# EAGLE schematic UDAWA-SensorWater (EAGLE 9.6.2)
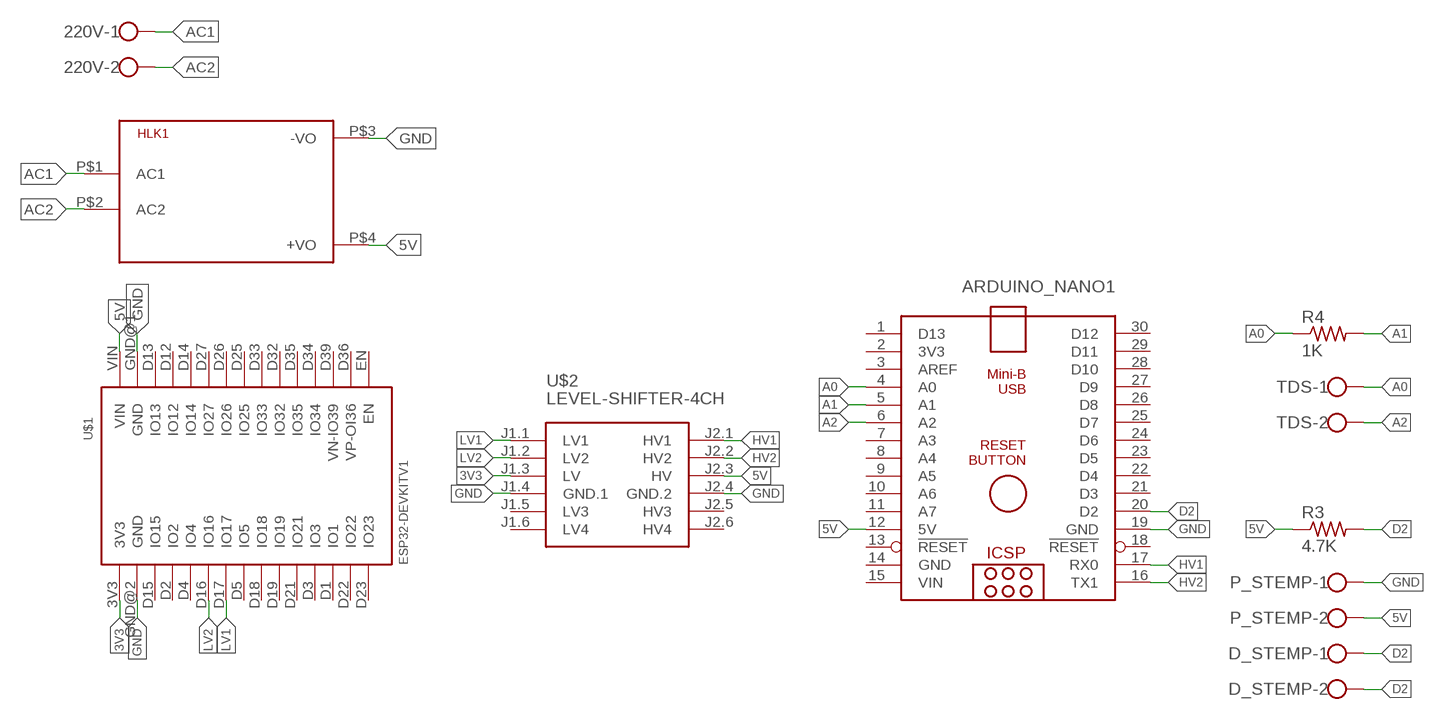
[diagram p0: schematic, sheet 1]

## Parts
220V  W237-102  [W237-102]
ARDUINO_NANO1  ARDUINO_NANO  [ARDUINO_NANO]
D_STEMP  W237-102  [W237-102]
HLK1  HLK-PM013W  [HLK-PM01]
P_STEMP  W237-102  [W237-102]
R3  4.7K  R-US_0204/7  [0204/7]
R4  1K  R-US_0204/7  [0204/7]
TDS  W237-102  [W237-102]
U$1  ESP32DEVKITV1  [ESP32-DEVKITV1]
U$2  LEVEL-SHIFTER-4CH  [LEVEL-SHIFTER-4CH]

## Nets
3V3: U$1.3V3 U$2.J1.3(LV)
5V: ARDUINO_NANO1.12(5V) HLK1.P$4(+VO) P_STEMP.2 R3.1 U$1.VIN U$2.J2.3(HV)
A0: ARDUINO_NANO1.4(A0) R4.1 TDS.1
A1: ARDUINO_NANO1.5(A1) R4.2
A2: ARDUINO_NANO1.6(A2) TDS.2
AC1: 220V.1 HLK1.P$1(AC1)
AC2: 220V.2 HLK1.P$2(AC2)
D2: ARDUINO_NANO1.20(D2) D_STEMP.1 D_STEMP.2 R3.2
GND: ARDUINO_NANO1.19(GND) HLK1.P$3(-VO) P_STEMP.1 U$1.GND@1(GND) U$1.GND@2(GND) U$2.J1.4(GND.1) U$2.J2.4(GND.2)
HV1: ARDUINO_NANO1.17(RX0) U$2.J2.1(HV1)
HV2: ARDUINO_NANO1.16(TX1) U$2.J2.2(HV2)
LV1: U$1.D17(IO17) U$2.J1.1(LV1)
LV2: U$1.D16(IO16) U$2.J1.2(LV2)
Unconnected: ARDUINO_NANO1.1(D13) ARDUINO_NANO1.2(3V3) ARDUINO_NANO1.3(AREF) ARDUINO_NANO1.7(A3) ARDUINO_NANO1.8(A4) ARDUINO_NANO1.9(A5) ARDUINO_NANO1.10(A6) ARDUINO_NANO1.11(A7) ARDUINO_NANO1.13(!RESET) ARDUINO_NANO1.18(!RESET) ARDUINO_NANO1.21(D3) ARDUINO_NANO1.22(D4) ARDUINO_NANO1.23(D5) ARDUINO_NANO1.24(D6) ARDUINO_NANO1.25(D7) ARDUINO_NANO1.26(D8) ARDUINO_NANO1.27(D9) ARDUINO_NANO1.28(D10) ARDUINO_NANO1.29(D11) ARDUINO_NANO1.30(D12) U$1.D1(IO1) U$1.D2(IO2) U$1.D3(IO3) U$1.D4(IO4) U$1.D5(IO5) U$1.D12(IO12) U$1.D13(IO13) U$1.D14(IO14) U$1.D15(IO15) U$1.D18(IO18) U$1.D19(IO19) U$1.D21(IO21) U$1.D22(IO22) U$1.D23(IO23) U$1.D25(IO25) U$1.D26(IO26) U$1.D27(IO27) U$1.D32(IO32) U$1.D33(IO33) U$1.D34(IO34) U$1.D35(IO35) U$1.D36(VP-OI36) U$1.D39(VN-IO39) U$1.EN U$2.J1.5(LV3) U$2.J1.6(LV4) U$2.J2.5(HV3) U$2.J2.6(HV4)

## Power pins joined to a net without a drawn wire
GND: ARDUINO_NANO1.14(GND)
VIN: ARDUINO_NANO1.15(VIN)

## Library data of the parts
220V D_STEMP P_STEMP TDS = con-wago-500:W237-102: WAGO SCREW CLAMP; MPN: 237-102; OC_FARNELL: unknown; OC_NEWARK: 70K9898
ARDUINO_NANO1 = ArduinoNanoV30:ARDUINO_NANO: Arduino Nano V3.0 Overview: The Arduino Nano is a small, complete, and breadboard-friendly board based on the ATmega328 (Arduino Nano 3.x) or ATmega168 (Arduino Nano 2.x). It has more or less the same functionality of the Arduino Duemilanove, but in a different package. It lacks only a DC power jack, and works with a Mini-B USB cable instead of a standard one. The Nano was designed and is being produced by Gravitech. Specifications: Microcontroller Atmel ATmega168 or ATmega328 Operating Voltage (logic level) 5 V Input Voltage (recommended) 7-12 V Input Voltage (limits) 6-20 V Digital I/O Pins 14 (of which 6 provide PWM output) Analog Input Pins 8 DC Current per I/O Pin 40 mA Flash Memory 16 KB (ATmega168) or 32 KB (ATmega328) of which 2 KB used by bootloader SRAM 1 KB (ATmega168) or 2 KB (ATmega328) EEPROM 512 bytes (ATmega168) or 1 KB (ATmega328) Clock Speed 16 MHz Dimensions 0.73" x 1.70" Length 45 mm Width 18 mm Weigth 5 g Power: The Arduino Nano can be powered via the Mini-B USB connection, 6-20V unregulated external power supply (pin 30), or 5V regulated external power supply (pin 27). The power source is automatically selected to the highest voltage source. Memory: The ATmega168 has 16 KB of flash memory for storing code (of which 2 KB is used for the bootloader); the ATmega328 has 32 KB, (also with 2 KB used for the bootloader). The ATmega168 has 1 KB of SRAM and 512 bytes of EEPROM (which can be read and written with the EEPROM library); the ATmega328 has 2 KB of SRAM and 1 KB of EEPROM. Input and Output: Each of the 14 digital pins on the Nano can be used as an input or output, using pinMode(), digitalWrite(), and digitalRead() functions. They operate at 5 volts. Each pin can provide or receive a maximum of 40 mA and has an internal pull-up resistor (disconnected by default) of 20-50 kOhms. In addition, some pins have specialized functions. Visit Arduino - ArduinoBoardNano <https://www.arduino.cc/en/Main/ArduinoBoardNano>
HLK1 = HLK-PM01:HLK-PM01: Hi-Link Power Supply HLK-PM01 3W Author: Ahmed Said <https://github.com/AhmedSaid/EAGLELibraries>
R3 R4 = rcl:R-US_: RESISTOR, American symbol; SPICEPREFIX: R
U$1 = ESP32-DEVKITV1:ESP32DEVKITV1
U$2 = diy-modules:LEVEL-SHIFTER-4CH: 4-Channel Bi-Directional Logic Level Converter based on BSS128 transistors Click here to find device on ebay.com <http://www.ebay.com/sch/i2c+logic+converter+module>